# Altium project My_Project_.PrjPcb
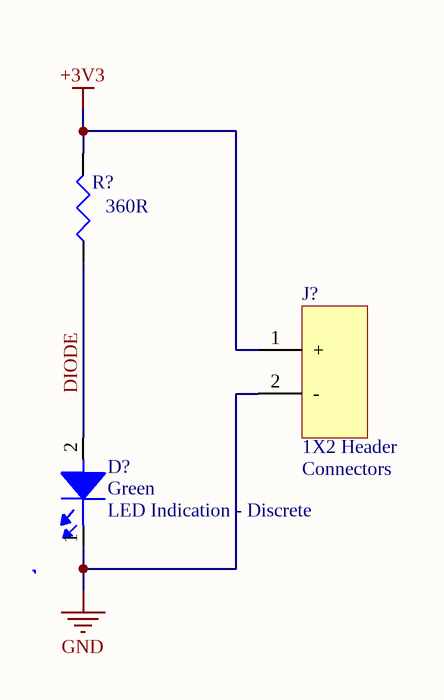
[diagram p0: Sheet1.SchDoc]
1 sheet, 3 parts. Net scope: global (net labels, ports and power ports of the same name join across sheets).
Board file: PCB1.PcbDoc

## Sheet Sheet1.SchDoc
size Letter; SheetNumber: 1; SheetTotal: 1

### Parts
D?  Green  Categories: LED Indication - Discrete
J?  1X2 Header  Categories: Connectors
R?  360R

### Nets
+3V3: J?.1(+) R?.2
GND: D?.1 J?.2(-)
DIODE: D?.2 R?.1

### Library data of the parts
D? = LNJ836W83RA: Single Color LED, Orange, 1.6mm; Manufacturer: Panasonic; Dominant Wavelength: 620nm; Forward Current: 20mA; Forward Voltage: 2.3V; Luminous Intensity: 17.5mcd; Number of Circuits: 1; Peak Wavelength: 630nm; Reverse Voltage: 4V; Shape: Rectangular; Test Current: 5mA; Supplier: DigiKey; Supplier Part Number: P14185CT-ND; Manufacturer Part Number: LNJ836W83RA; RoHS: Compliant; Category: LEDs; Stock: 4049; Pricing: 1=0.3, 10=0.205, 100=0.1533, 500=0.13198, 1000=0.12529, 2000=0.11974 (USD); Case/Package: 0603; Case Code (Imperial): 0603; Case Code (Metric): 1608; Color: Orange; Height: 200µm; Length: 1.6mm; Lifecycle Status: Obsolete; Max Operating Temperature: 85°C; Min Operating Temperature: -30°C; Mounting Technology: Surface Mount; Number of Terminals: 2; Packaging: Bulk; Width: 800µm; ComponentLink1URL: https://datasheet.octopart.com:443/LNJ836W83RA-Panasonic-datasheet-180976350.pdf?src-supplier=IHS; ComponentLink1Description: https://datasheet.octopart.com:443/LNJ836W83RA-Panasonic-datasheet-180976350.pdf?src-supplier=IHS
J? = 22-29-2021: KK 254 Wire-to-Board Header, Vertical, with Friction Lock, 2 Circuits, Gold (Au) Plating; Manufacturer: Molex; Manufacturer Lifecycle Status: ACTIVE; Contact Resistance: 10mΩ; Current Rating: 4A; Dielectric Material: Polyamide; Gender: Male; Glow Wire Compliant: Non-compliant; Insulation Resistance: 1GΩ; Max Voltage Rating (AC): 250V; Number of Circuits: 2; Pitch: 2.54mm; Plating: Tin; Plating Thickness: 508nm; Voltage Rating: 500V; Supplier: Avnet; Supplier Part Number: 13T9052; Manufacturer Part Number: 22-29-2021; RoHS: Compliant; Category: Headers and Wire Housings; Stock: 3134; Pricing: 1=0.431, 10=0.342, 25=0.324, 50=0.319, 100=0.313, 250=0.301, 500=0.288 (USD); China RoHS: Compliant; Color: White; Contact Gender: Male; Contact Material: Brass; Contact Plating: Gold; Country of Origin: US; Depth: 5.8mm; Export Control Classification Number (ECCN) Code: EAR99; Flammability Rating: UL94 V-0; Halogen Free: Low Halogen; Height: 12.05mm; Housing Color: White; Housing Material: Nylon; Harmonized Tariff Schedule (HTS) Code: 8536.69.40.40; Introduction Date: 2010-04-20; Lead Free: Lead Free; Lead Pitch: 2.54mm; Length: 12.7mm; Lifecycle Status: Production; Max Current Rating: 4A; Max Operating Temperature: 75°C; Min Operating Temperature: 0°C; Mounting Technology: Through Hole; Number of Contacts: 2; Pins: 2; Number of Positions: 2; Number of Rows: 1; Orientation: Right Angle, Vertical; Packaging: Bulk; Radiation Hardening: No; REACH SVHC: Yes; Schedule B: 8536694040, 8536694040|8536694040|8536694040|8536694040|8536694040|8536694040|8536694040|8536694040|8536694040|8536694040|8536694040|8536694040|8536694040|8536694040|8536694040|8536694040|8536694040|8536694040|8536694040|8536694040|8536694040|8536694040|8536694040|85; Terminal Pitch: 2.54mm; Termination: Through Hole; Voltage Rating (DC): 250V; ComponentLink1URL: https://sigma.octopart.com:443/81843831/technical_drawing/Molex-22-29-2021.pdf?src-supplier=Upverter; ComponentLink1Description: https://sigma.octopart.com:443/81843831/technical_drawing/Molex-22-29-2021.pdf?src-supplier=Upverter; ComponentLink2URL: https://datasheet.octopart.com:443/22-29-2021-Molex-datasheet-12556036.pdf?src-supplier=Molex; ComponentLink2Description: https://datasheet.octopart.com:443/22-29-2021-Molex-datasheet-12556036.pdf?src-supplier=Molex; ComponentLink3URL: https://datasheet.octopart.com:443/22-29-2021-Molex-datasheet-10979409.pdf?src-supplier=Molex; ComponentLink3Description: https://datasheet.octopart.com:443/22-29-2021-Molex-datasheet-10979409.pdf?src-supplier=Molex; ComponentLink4URL: https://datasheet.octopart.com:443/022292021-Molex-datasheet-5315839.pdf?src-supplier=Farnell; ComponentLink4Description: https://datasheet.octopart.com:443/022292021-Molex-datasheet-5315839.pdf?src-supplier=Farnell; ComponentLink5URL: https://datasheet.octopart.com:443/22-29-2021-Molex-datasheet-101581899.pdf?src-supplier=Farnell; ComponentLink5Description: https://datasheet.octopart.com:443/22-29-2021-Molex-datasheet-101581899.pdf?src-supplier=Farnell; ComponentLink6URL: https://datasheet.octopart.com:443/22-29-2021-Molex-datasheet-13556931.pdf?src-supplier=Farnell; ComponentLink6Description: https://datasheet.octopart.com:443/22-29-2021-Molex-datasheet-13556931.pdf?src-supplier=Farnell; ComponentLink7URL: https://datasheet.octopart.com:443/22-29-2021-Molex-datasheet-506551.pdf?src-supplier=Farnell; ComponentLink7Description: https://datasheet.octopart.com:443/22-29-2021-Molex-datasheet-506551.pdf?src-supplier=Farnell; ComponentLink8URL: https://datasheet.octopart.com:443/22-29-2021-Molex-datasheet-193086454.pdf?src-supplier=JRH+Electronics; ComponentLink8Description: https://datasheet.octopart.com:443/22-29-2021-Molex-datasheet-193086454.pdf?src-supplier=JRH+Electronics; ComponentLink9URL: https://datasheet.octopart.com:443/22-29-2021-Molex-datasheet-154747399.pdf?src-supplier=JRH+Electronics; ComponentLink9Description: https://datasheet.octopart.com:443/22-29-2021-Molex-datasheet-154747399.pdf?src-supplier=JRH+Electronics; ComponentLink10URL: https://datasheet.octopart.com:443/22-29-2021-Molex-datasheet-140181368.pdf?src-supplier=RS+(Formerly+Allied+Electronics); ComponentLink10Description: https://datasheet.octopart.com:443/22-29-2021-Molex-datasheet-140181368.pdf?src-supplier=RS+(Formerly+Allied+Electronics); ComponentLink11URL: https://datasheet.octopart.com:443/22-29-2021-Molex-datasheet-120146429.pdf?src-supplier=RS+(Formerly+Allied+Electronics); ComponentLink11Description: https://datasheet.octopart.com:443/22-29-2021-Molex-datasheet-120146429.pdf?src-supplier=RS+(Formerly+Allied+Electronics); ComponentLink12URL: https://datasheet.octopart.com:443/22-29-2021-Molex-datasheet-62280240.pdf?src-supplier=Electro+Sonic; ComponentLink12Description: https://datasheet.octopart.com:443/22-29-2021-Molex-datasheet-62280240.pdf?src-supplier=Electro+Sonic; ComponentLink13URL: https://datasheet.octopart.com:443/22-29-2021-Molex-datasheet-37169030.pdf?src-supplier=Electro+Sonic; ComponentLink13Description: https://datasheet.octopart.com:443/22-29-2021-Molex-datasheet-37169030.pdf?src-supplier=Electro+Sonic; ComponentLink14URL: https://datasheet.octopart.com:443/22-29-2021-Molex-datasheet-23709171.pdf?src-supplier=Electro+Sonic; ComponentLink14Description: https://datasheet.octopart.com:443/22-29-2021-Molex-datasheet-23709171.pdf?src-supplier=Electro+Sonic; ComponentLink15URL: https://datasheet.octopart.com:443/22-29-2021-Molex-datasheet-33002381.pdf?src-supplier=Newark; ComponentLink15Description: https://datasheet.octopart.com:443/22-29-2021-Molex-datasheet-33002381.pdf?src-supplier=Newark; ComponentLink16URL: https://datasheet.octopart.com:443/22-29-2021-Molex-datasheet-21827057.pdf?src-supplier=Newark; ComponentLink16Description: https://datasheet.octopart.com:443/22-29-2021-Molex-datasheet-21827057.pdf?src-supplier=Newark; ComponentLink17URL: https://datasheet.octopart.com:443/22-29-2021-Molex-datasheet-21206998.pdf?src-supplier=Newark; ComponentLink17Description: https://datasheet.octopart.com:443/22-29-2021-Molex-datasheet-21206998.pdf?src-supplier=Newark; ComponentLink18URL: https://datasheet.octopart.com:443/22-29-2021-Molex-datasheet-144804.pdf?src-supplier=DigiKey; ComponentLink18Description: https://datasheet.octopart.com:443/22-29-2021-Molex-datasheet-144804.pdf?src-supplier=DigiKey; ComponentLink19URL: https://datasheet.octopart.com:443/22-29-2021-Molex-datasheet-7277451.pdf?src-supplier=Jameco; ComponentLink19Description: https://datasheet.octopart.com:443/22-29-2021-Molex-datasheet-7277451.pdf?src-supplier=Jameco; ComponentLink20URL: https://datasheet.octopart.com:443/22-29-2021-Molex-datasheet-17586671.pdf?src-supplier=TME; ComponentLink20Description: https://datasheet.octopart.com:443/22-29-2021-Molex-datasheet-17586671.pdf?src-supplier=TME; ComponentLink21URL: http://sigma.octopart.com:80/16301842/rohs_statement/Molex-22-29-2021.pdf?src-supplier=Compliance+Statements; ComponentLink21Description: http://sigma.octopart.com:80/16301842/rohs_statement/Molex-22-29-2021.pdf?src-supplier=Compliance+Statements; ComponentLink22URL: http://sigma.octopart.com:80/reach_statement/Molex-company-74.pdf?src-supplier=Compliance+Statements; ComponentLink22Description: http://sigma.octopart.com:80/reach_statement/Molex-company-74.pdf?src-supplier=Compliance+Statements; ComponentLink23URL: http://sigma.octopart.com:80/rohs_statement/Molex-company-73.pdf?src-supplier=Compliance+Statements; ComponentLink23Description: http://sigma.octopart.com:80/rohs_statement/Molex-company-73.pdf?src-supplier=Compliance+Statements; ComponentLink24URL: http://sigma.octopart.com:80/conflict_mineral_statement/Molex-company-72.pdf?src-supplier=Compliance+Statements; ComponentLink24Description: http://sigma.octopart.com:80/conflict_mineral_statement/Molex-company-72.pdf?src-supplier=Compliance+Statements
R? = CRCW0805360RFKEA: Fixed Resistor, Metal Glaze/Thick Film, 0.125W, 360ohm, 150V, 1% +/-Tol, Surface Mount, 0805; Manufacturer: Vishay; Manufacturer Package Identifier: CRCW0805-e3; Max Power Dissipation: 125mW; Value: 360Ω; Temperature Coefficient: 100ppm/°C; Categories: Resistors; Supplier: Avnet; Supplier Part Number: CRCW0805360RFKEA; Manufacturer Part Number: CRCW0805360RFKEA; RoHS: Compliant; Category: Chip SMD Resistors; Pricing: 20000=0.02, 40000=0.01918, 80000=0.01867, 160000=0.01795, 320000=0.01687 (USD); Case/Package: 0805; Case Code (Imperial): 0805; China RoHS: Non-Compliant; Composition: Thick Film; Contact Plating: Tin; Country of Origin: Israel; Depth: 1.25mm; Export Control Classification Number (ECCN) Code: EAR99; Features: Automotive AEC-Q200; Height: 450µm; Harmonized Tariff Schedule (HTS) Code: 8533.21.00.30; Introduction Date: 2005-02-16; Lead Free: Lead Free; Length: 2mm; Lifecycle Status: Production; Max Operating Temperature: 155°C; Military Standard: Not; Min Operating Temperature: -55°C; Mounting Technology: Surface Mount; Pins: 2; Number of Terminals: 2; Number of Terminations: 2; Packaging: Cut Tape; Power Dissipation: 125mW; Power Rating: 125mW; Radiation Hardening: No; REACH SVHC: Yes; Schedule B: 8533210045, 8533210045|8533210045, 8533210045|8533210045|8533210045, 8533210045|8533210045|8533210045|8533210045; Termination: SMD/SMT; Tolerance: 1%; Voltage Rating: 150V; Voltage Rating (DC): 150V; Weight: 5.499807mg; Width: 1.25mm; Working Voltage: 150V; ComponentLink1URL: https://datasheet.octopart.com:443/CRCW0805360RFKEA-Vishay-datasheet-175423584.pdf?src-supplier=IHS; ComponentLink1Description: https://datasheet.octopart.com:443/CRCW0805360RFKEA-Vishay-datasheet-175423584.pdf?src-supplier=IHS; ComponentLink2URL: https://datasheet.octopart.com:443/CRCW0805360RFKEA-Vishay-datasheet-66077789.pdf?src-supplier=element14+APAC; ComponentLink2Description: https://datasheet.octopart.com:443/CRCW0805360RFKEA-Vishay-datasheet-66077789.pdf?src-supplier=element14+APAC; ComponentLink3URL: https://datasheet.octopart.com:443/CRCW0805360RFKEA-Vishay-datasheet-62317937.pdf?src-supplier=element14+APAC; ComponentLink3Description: https://datasheet.octopart.com:443/CRCW0805360RFKEA-Vishay-datasheet-62317937.pdf?src-supplier=element14+APAC; ComponentLink4URL: https://datasheet.octopart.com:443/CRCW0805360RFKEA-Vishay-datasheet-33013972.pdf?src-supplier=element14+APAC; ComponentLink4Description: https://datasheet.octopart.com:443/CRCW0805360RFKEA-Vishay-datasheet-33013972.pdf?src-supplier=element14+APAC; ComponentLink5URL: https://datasheet.octopart.com:443/CRCW0805360RFKEA.-Vishay-datasheet-83961561.pdf?src-supplier=element14+APAC; ComponentLink5Description: https://datasheet.octopart.com:443/CRCW0805360RFKEA.-Vishay-datasheet-83961561.pdf?src-supplier=element14+APAC; ComponentLink6URL: https://datasheet.octopart.com:443/CRCW0805360RFKEA-Vishay-datasheet-14722531.pdf?src-supplier=element14+APAC; ComponentLink6Description: https://datasheet.octopart.com:443/CRCW0805360RFKEA-Vishay-datasheet-14722531.pdf?src-supplier=element14+APAC; ComponentLink7URL: https://datasheet.octopart.com:443/CRCW0805360RFKEA-Vishay-datasheet-31669108.pdf?src-supplier=Farnell; ComponentLink7Description: https://datasheet.octopart.com:443/CRCW0805360RFKEA-Vishay-datasheet-31669108.pdf?src-supplier=Farnell; ComponentLink8URL: https://datasheet.octopart.com:443/CRCW0805360RFKEA-Vishay-datasheet-11761042.pdf?src-supplier=Newark; ComponentLink8Description: https://datasheet.octopart.com:443/CRCW0805360RFKEA-Vishay-datasheet-11761042.pdf?src-supplier=Newark; ComponentLink9URL: https://datasheet.octopart.com:443/CRCW0805360RFKEA-Vishay-datasheet-11516975.pdf?src-supplier=Newark; ComponentLink9Description: https://datasheet.octopart.com:443/CRCW0805360RFKEA-Vishay-datasheet-11516975.pdf?src-supplier=Newark; ComponentLink10URL: https://datasheet.octopart.com:443/CRCW0805360RFKEA-Vishay-datasheet-159614168.pdf?src-supplier=Newark; ComponentLink10Description: https://datasheet.octopart.com:443/CRCW0805360RFKEA-Vishay-datasheet-159614168.pdf?src-supplier=Newark; ComponentLink11URL: https://datasheet.octopart.com:443/CRCW0805360RFKEA-Vishay-datasheet-41302739.pdf?src-supplier=Newark; ComponentLink11Description: https://datasheet.octopart.com:443/CRCW0805360RFKEA-Vishay-datasheet-41302739.pdf?src-supplier=Newark; ComponentLink12URL: https://datasheet.octopart.com:443/CRCW0805360RFKEA-Vishay-datasheet-62316122.pdf?src-supplier=Future+Electronics; ComponentLink12Description: https://datasheet.octopart.com:443/CRCW0805360RFKEA-Vishay-datasheet-62316122.pdf?src-supplier=Future+Electronics; ComponentLink13URL: https://datasheet.octopart.com:443/CRCW0805360RFKEA-Vishay-datasheet-12519820.pdf?src-supplier=Future+Electronics; ComponentLink13Description: https://datasheet.octopart.com:443/CRCW0805360RFKEA-Vishay-datasheet-12519820.pdf?src-supplier=Future+Electronics; ComponentLink14URL: https://datasheet.octopart.com:443/CRCW0805360RFKEA-Vishay-Dale-datasheet-47688880.pdf?src-supplier=RS+(Formerly+Allied+Electronics); ComponentLink14Description: https://datasheet.octopart.com:443/CRCW0805360RFKEA-Vishay-Dale-datasheet-47688880.pdf?src-supplier=RS+(Formerly+Allied+Electronics); ComponentLink15URL: https://datasheet.octopart.com:443/CRCW0805360RFKEA-Vishay-datasheet-12001583.pdf?src-supplier=RS+(Formerly+Allied+Electronics); ComponentLink15Description: https://datasheet.octopart.com:443/CRCW0805360RFKEA-Vishay-datasheet-12001583.pdf?src-supplier=RS+(Formerly+Allied+Electronics); ComponentLink16URL: https://datasheet.octopart.com:443/CRCW0805360RFKEA-Vishay-datasheet-5306405.pdf?src-supplier=RS+(Formerly+Allied+Electronics); ComponentLink16Description: https://datasheet.octopart.com:443/CRCW0805360RFKEA-Vishay-datasheet-5306405.pdf?src-supplier=RS+(Formerly+Allied+Electronics); ComponentLink17URL: https://datasheet.octopart.com:443/CRCW0805360RFKEA-Vishay-datasheet-8445837.pdf?src-supplier=element14; ComponentLink17Description: https://datasheet.octopart.com:443/CRCW0805360RFKEA-Vishay-datasheet-8445837.pdf?src-supplier=element14; ComponentLink18URL: http://sigma.octopart.com:80/rohs_statement/Vishay-company-15.pdf?src-supplier=Compliance+Statements; ComponentLink18Description: http://sigma.octopart.com:80/rohs_statement/Vishay-company-15.pdf?src-supplier=Compliance+Statements